# EAGLE design observer (EAGLE 6.4)
AUTHOR: B. Campbell, N. Jackson, C. Kreng, A. Zhen; REV: C; TITLE: Observer

## Sheet 1 of 2
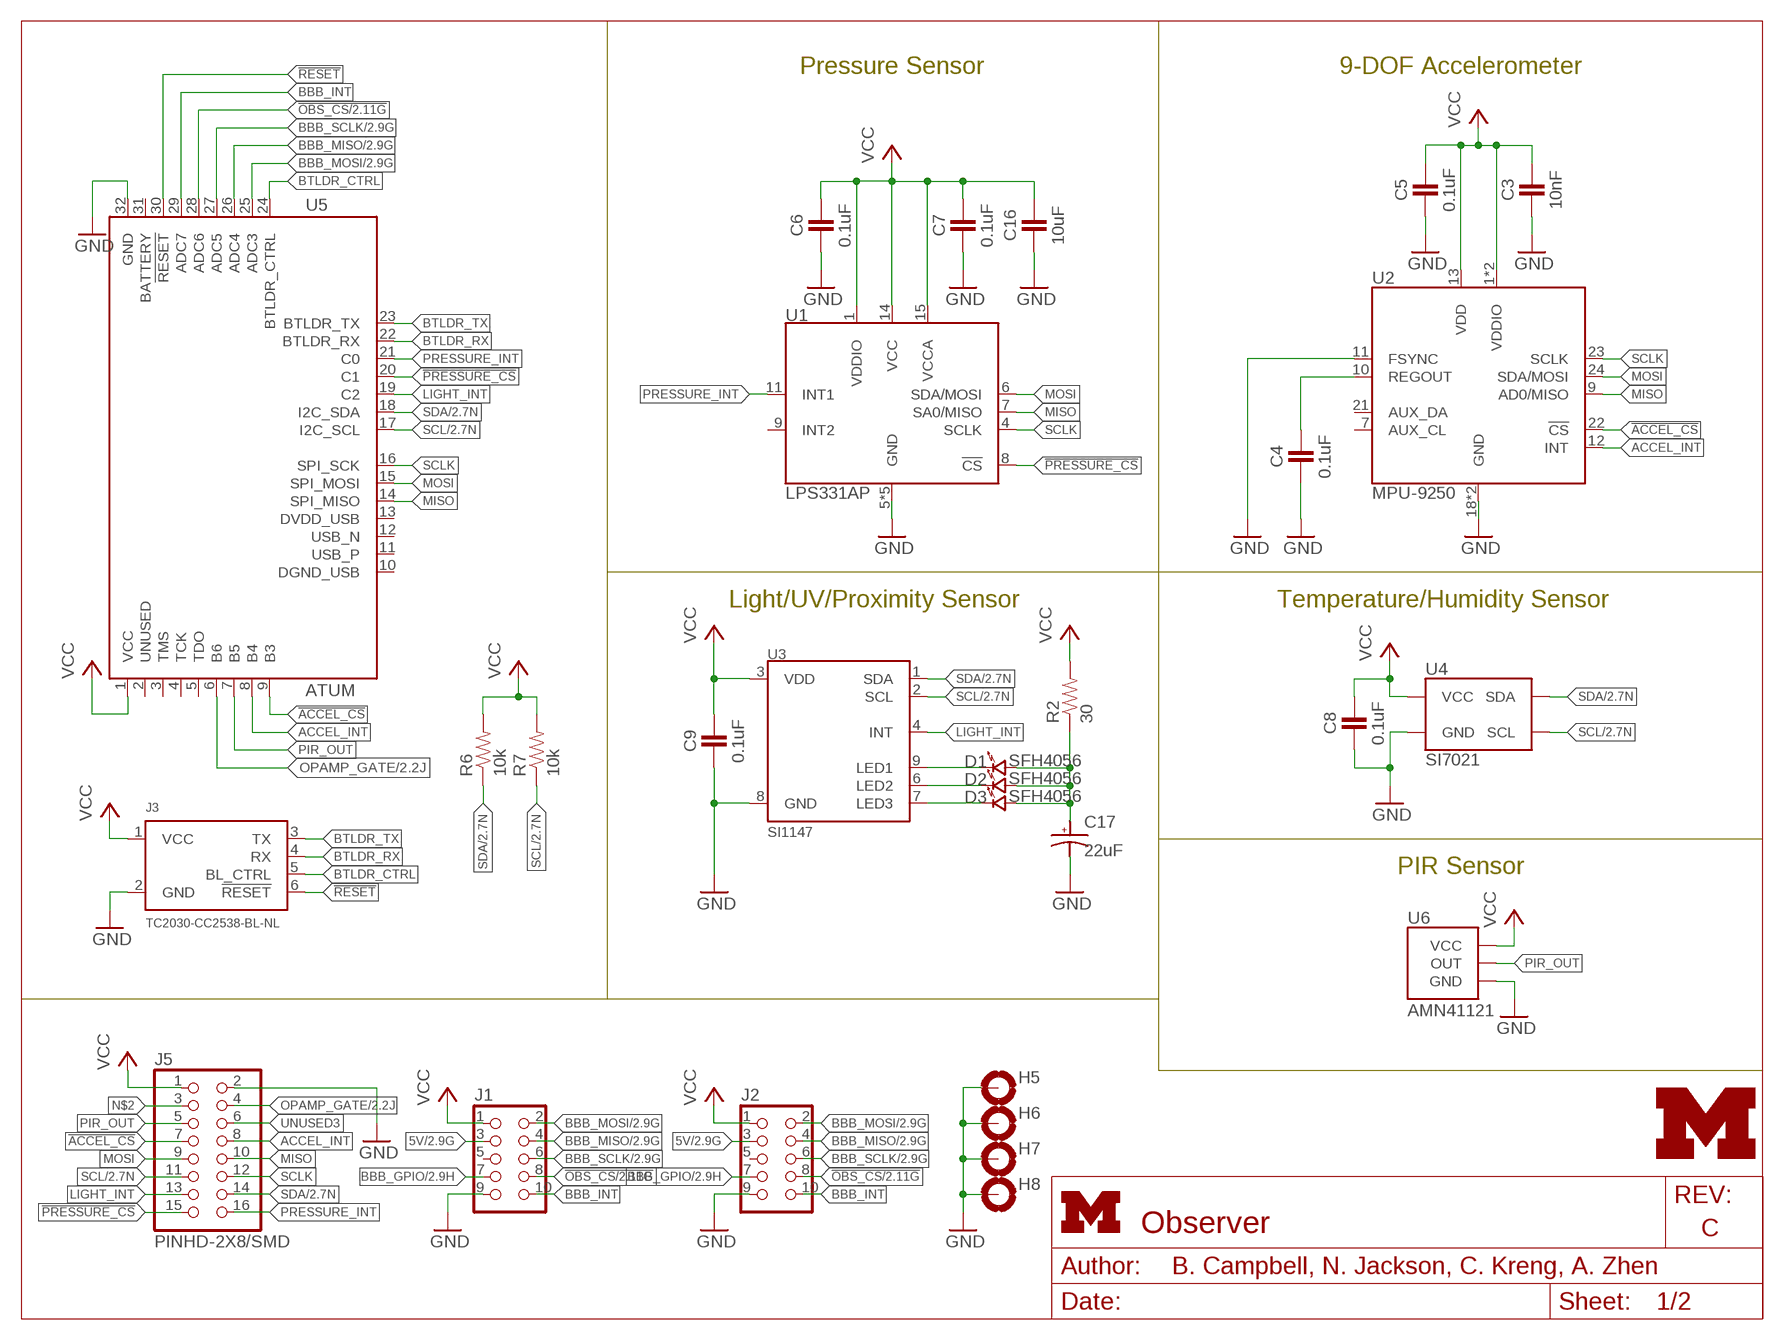
[diagram p0: schematic, sheet 1]
FRAME1 (LETTER_L): HEIGHT: 8.5in; WIDTH: 11in

### Parts
C3  10nF  CAPACITOR  [0402_CAP]
C4  0.1uF  CAPACITOR  [0402_CAP]
C5  0.1uF  CAPACITOR  [0402_CAP]
C6  0.1uF  CAPACITOR  [0402_CAP]
C7  0.1uF  CAPACITOR  [0402_CAP]
C8  0.1uF  CAPACITOR  [0402_CAP]
C9  0.1uF  CAPACITOR  [0402_CAP]
C16  10uF  CAPACITOR  [0402_CAP]
C17  22uF  CAP_POL0603  [CAP0603]
D1  SFH4056  [SFH4056]
D2  SFH4056  [SFH4056]
D3  SFH4056  [SFH4056]
H5  MOUNT-PAD-ROUND3.2  [3,2-PAD]
H6  MOUNT-PAD-ROUND3.2  [3,2-PAD]
H7  MOUNT-PAD-ROUND3.2  [3,2-PAD]
H8  MOUNT-PAD-ROUND3.2  [3,2-PAD]
J1  CON_HEADER_2X05-SMD+SHROUDED  [PINSHRD_SMT_2X05]
J2  CON_HEADER_2X05-SMD+SHROUDED  [PINSHRD_SMT_2X05]
J3  TC2030-CC2538-BL-NL  [TC2030-IDC-NL]
J5  PINHD-2X8/SMD  [2X8/SMD]
LOGO1  UMICH_SOLID_TINY  [UMICH_SOLID_50MIL]
R2  30  RESISTOR0402_RES  [0402_RES]
R6  10k  RESISTOR0402_RES  [0402_RES]
R7  10k  RESISTOR0402_RES  [0402_RES]
U1  LPS331AP  [HCLGA-16/3MM]
U2  MPU-9250  [QFN-24/3MM]
U3  SI1147  [QFN-10/2MM]
U4  SI7021  [DFN-6/3MM]
U5  ATUM  [ATUM]
U6  AMN41121  [AMN2]

### Nets
5V: J1.3 J2.3 ; also sheet 2
!ACCEL_CS: J5.7 U2.22(!CS) U5.9(B3)
!OBS_CS: J1.8 J2.8 U5.28(ADC6) ; also sheet 2
!PRESSURE_CS: J5.15 U1.8(!CS) U5.20(C1)
!RESET: J3.6(!RESET) U5.30(!RESET)
ACCEL_INT: J5.8 U2.12(INT) U5.8(B4)
BBB_GPIO: J1.7 J2.7 ; also sheet 2
BBB_INT: J1.10 J2.10 U5.29(ADC7)
BBB_MISO: J1.4 J2.4 U5.26(ADC4) ; also sheet 2
BBB_MOSI: J1.2 J2.2 U5.25(ADC3) ; also sheet 2
BBB_SCLK: J1.6 J2.6 U5.27(ADC5) ; also sheet 2
BTLDR_CTRL: J3.5(BL_CTRL) U5.24(BTLDR_CTRL)
BTLDR_RX: J3.4(RX) U5.22(BTLDR_RX)
BTLDR_TX: J3.3(TX) U5.23(BTLDR_TX)
GND: C3.2 C4.2 C5.2 C6.2 C7.2 C8.2 C9.2 C16.2 C17.NEG(ANODE) H5.B3,2(MOUNT) H6.B3,2(MOUNT) H7.B3,2(MOUNT) H8.B3,2(MOUNT) J1.9 J2.9 J3.2(GND) J5.2 U1.5(GND) U1.10(GND) U1.12(GND) U1.13(GND) U1.16(GND) U2.11(FSYNC) U2.18(GND) U2.20(GND) U3.8(GND) U4.2(GND) U5.32(GND) U6.GND ; also sheet 2
LIGHT_INT: J5.13 U3.4(INT) U5.19(C2)
MISO: J5.10 U1.7(SA0/MISO) U2.9(AD0/MISO) U5.14(SPI_MISO)
MOSI: J5.9 U1.6(SDA/MOSI) U2.24(SDA/MOSI) U5.15(SPI_MOSI)
N$2: J5.3
N$3: C4.1 U2.10(REGOUT)
N$4: D1.CATHODE U3.9(LED1)
N$6: D2.CATHODE U3.6(LED2)
N$7: D3.CATHODE U3.7(LED3)
N$8: C17.POS(CATHODE) D1.ANODE D2.ANODE D3.ANODE R2.1
OPAMP_GATE: J5.4 U5.6(B6) ; also sheet 2
PIR_OUT: J5.5 U5.7(B5) U6.OUT
PRESSURE_INT: J5.16 U1.11(INT1) U5.21(C0)
SCL: J5.11 R7.1 U3.2(SCL) U4.6(SCL) U5.17(I2C_SCL) ; also sheet 2
SCLK: J5.12 U1.4(SCLK) U2.23(SCLK) U5.16(SPI_SCK)
SDA: J5.14 R6.1 U3.1(SDA) U4.1(SDA) U5.18(I2C_SDA) ; also sheet 2
UNUSED3: J5.6
VCC: C3.1 C5.1 C6.1 C7.1 C8.1 C9.1 C16.1 J1.1 J2.1 J3.1(VCC) J5.1 R2.2 R6.2 R7.2 U1.1(VDDIO) U1.14(VCC) U1.15(VCCA) U2.1(VDDIO) U2.8(VDDIO) U2.13(VDD) U3.3(VDD) U4.5(VCC) U5.1(VCC) U6.VCC ; also sheet 2
Unconnected: J1.5 J2.5 U1.9(INT2) U2.7(AUX_CL) U2.21(AUX_DA) U5.2(UNUSED) U5.3(TMS) U5.4(TCK) U5.5(TDO) U5.10(DGND_USB) U5.11(USB_P) U5.12(USB_N) U5.13(DVDD_USB) U5.31(BATTERY)

### Notes on the sheet
- Pressure Sensor | 9-DOF Accelerometer
- Light/UV/Proximity Sensor | Temperature/Humidity Sensor
- PIR Sensor

## Sheet 2 of 2
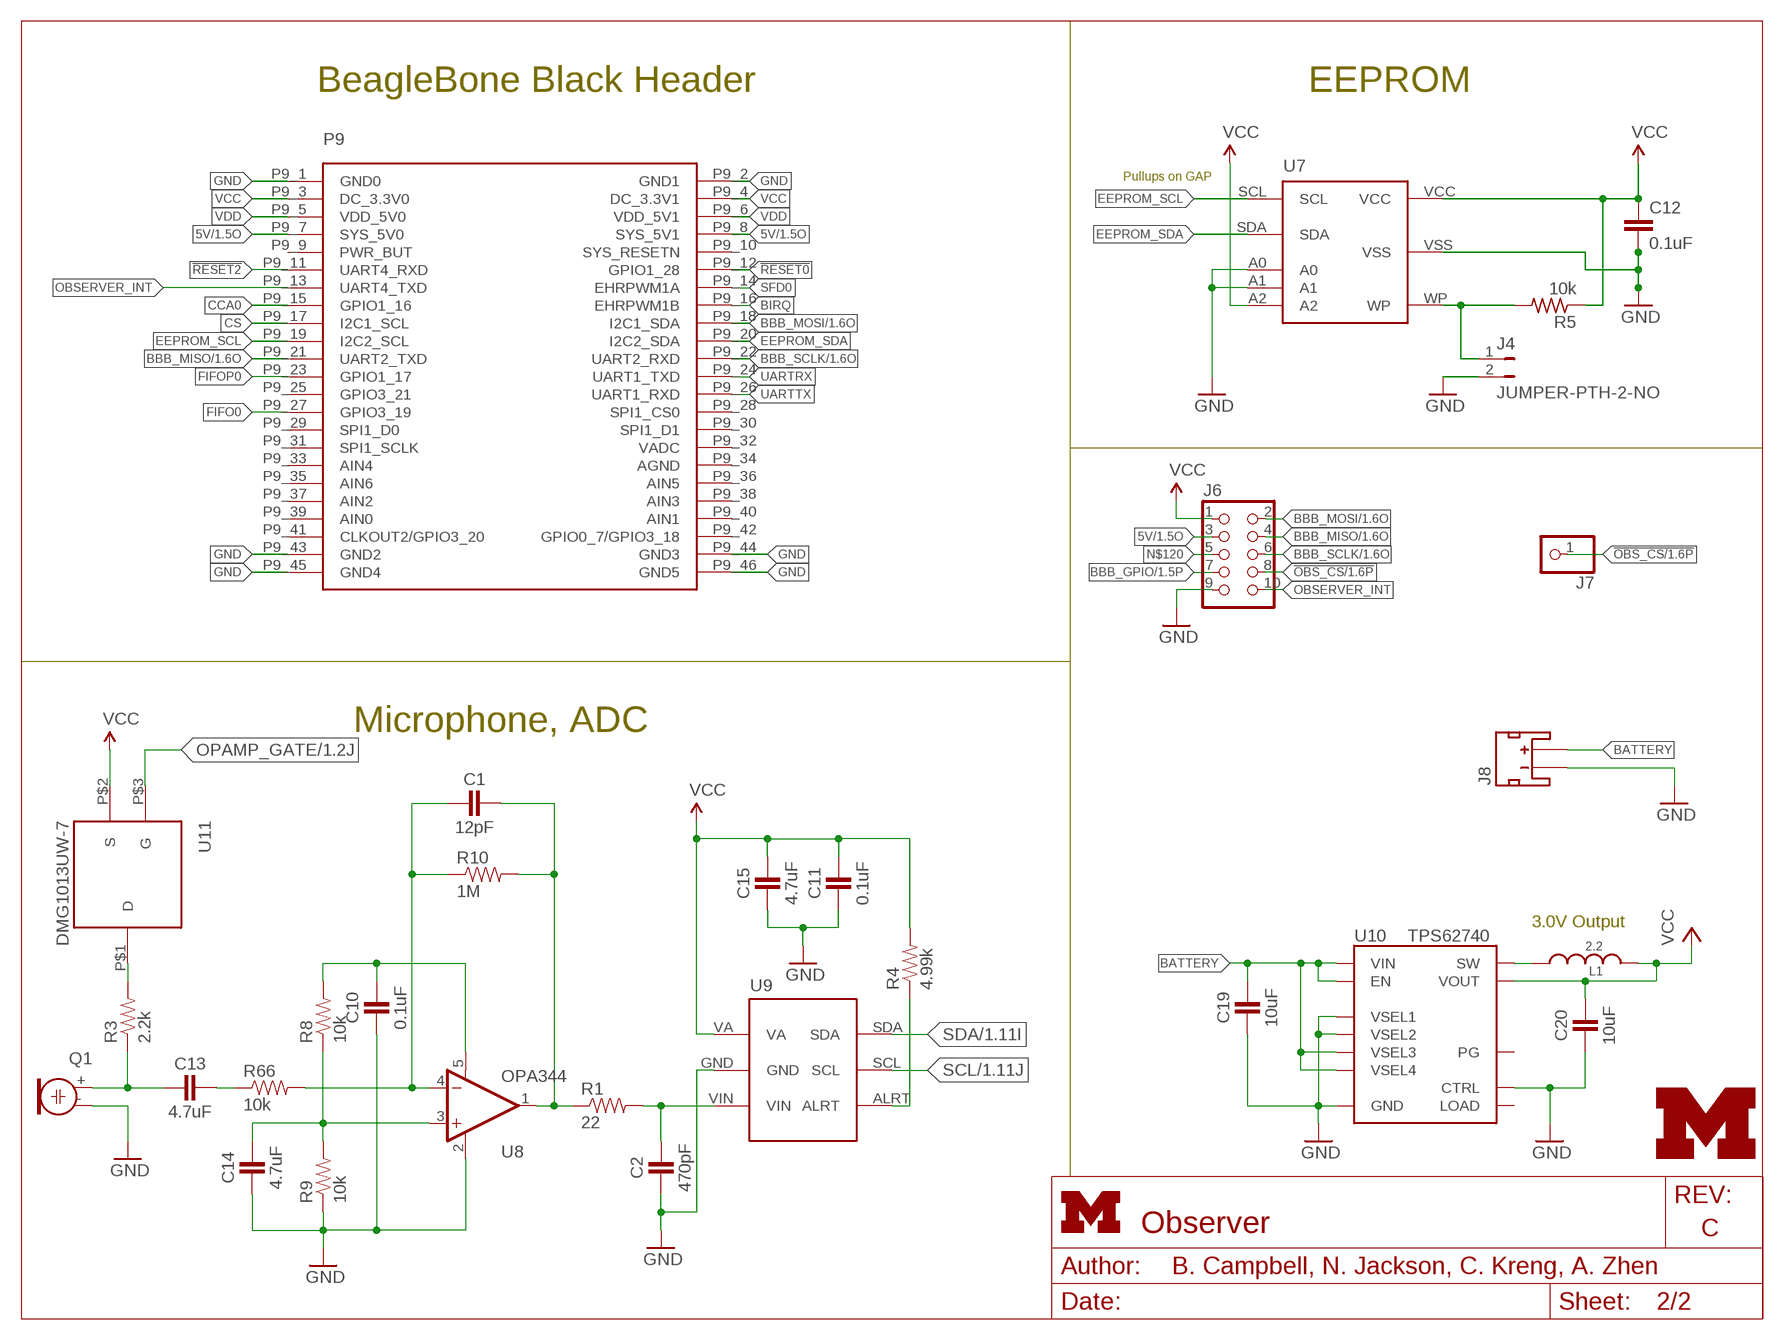
[diagram p1: schematic, sheet 2]
FRAME2 (LETTER_L): HEIGHT: 8.5in; WIDTH: 11in

### Parts
C1  12pF  CAPACITOR  [0402_CAP]
C2  470pF  CAPACITOR  [0402_CAP]
C10  0.1uF  CAPACITOR  [0402_CAP]
C11  0.1uF  CAPACITOR  [0402_CAP]
C12  0.1uF  C-EUC0402  [C0402]
C13  4.7uF  CAPACITOR  [0402_CAP]
C14  4.7uF  CAPACITOR  [0402_CAP]
C15  4.7uF  CAPACITOR  [0402_CAP]
C19  10uF  CAPACITOR0603_CAP  [0603_CAP]
C20  10uF  CAPACITOR0603_CAP  [0603_CAP]
J4  JUMPER-PTH-2-NO  [PTH-JUMPER-2-NO_NO_SILK]
J6  CON_HEADER_2X05-PTH+SHROUDED_A  [PINSHRD_PTH_2X05]
J7  PINHD-1X1  [1X01]
J8  JST_2MM_MALE  [JST-2-SMD]
L1  2.2  MIPSZ2012D  [MIPSZ201D]
LOGO2  UMICH_SOLID_TINY  [UMICH_SOLID_50MIL]
P9/P8  BBB_HEADER  [BBB_HEADERS]
Q1  ELECTRET  [ELECTRET_9.7]
R1  22  RESISTOR0402_RES  [0402_RES]
R3  2.2k  RESISTOR0402_RES  [0402_RES]
R4  4.99k  RESISTOR0402_RES  [0402_RES]
R5  10k  R-US_R0402  [R0402]
R8  10k  RESISTOR0402_RES  [0402_RES]
R9  10k  RESISTOR0402_RES  [0402_RES]
R10  1M  RESISTOR0402_RES  [0402_RES]
R66  10k  RESISTOR0402_RES  [0402_RES]
U7  CAT24C256WI-GT3  [CAT24C256WI-GT3]
U8  OPA344  [SOT23-5]
U9  ADC121C021  [ADC121C021]
U10  TPS62740  [R-PWSON-12]
U11  DMG1013UW-7  [SOT-323]

### Nets
5V: J6.3 P9/P8.P9_7(SYS_5V0) P9/P8.P9_8(SYS_5V1) ; also sheet 1
!OBS_CS: J6.8 J7.1 ; also sheet 1
!RESET0: P9/P8.P9_12(GPIO1_28)
!RESET2: P9/P8.P9_11(UART4_RXD)
BATTERY: C19.1 J8.2(+) U10.1(VIN) U10.8(VSEL4) U10.9(VSEL3) U10.12(EN)
BBB_GPIO: J6.7 ; also sheet 1
BBB_MISO: J6.4 P9/P8.P9_21(UART2_TXD) ; also sheet 1
BBB_MOSI: J6.2 P9/P8.P9_18(I2C1_SDA) ; also sheet 1
BBB_SCLK: J6.6 P9/P8.P9_22(UART2_RXD) ; also sheet 1
BIRQ: P9/P8.P9_16(EHRPWM1B)
CCA0: P9/P8.P9_15(GPIO1_16)
CS: P9/P8.P9_17(I2C1_SCL)
EEPROM_SCL: P9/P8.P9_19(I2C2_SCL) U7.SCL
EEPROM_SDA: P9/P8.P9_20(I2C2_SDA) U7.SDA
FIFO0: P9/P8.P9_27(GPIO3_19)
FIFOP0: P9/P8.P9_23(GPIO1_17)
GND: C2.2 C10.2 C11.2 C12.2 C14.2 C15.2 C19.2 C20.2 J4.2 J6.9 J8.1(-) P9/P8.P9_1(GND0) P9/P8.P9_2(GND1) P9/P8.P9_43(GND2) P9/P8.P9_44(GND3) P9/P8.P9_45(GND4) P9/P8.P9_46(GND5) Q1.- R9.1 U7.A0 U7.A1 U7.VSS U8.2(V-) U9.GND U10.3(GND) U10.4(CTRL) U10.10(VSEL2) U10.11(VSEL1) U10.NC(GND) ; also sheet 1
MIC_AIN: C1.1 R1.1 R10.2 U8.1(OUT)
MIC_INT: R4.1 U9.ALRT
N$1: C13.2 Q1.+ R3.1
N$5: C13.1 R66.1
N$9: C1.2 R10.1 R66.2 U8.4(-IN)
N$10: C14.1 R8.1 R9.2 U8.3(+IN)
N$11: C2.1 R1.2 U9.VIN
N$12: L1.1 U10.2(SW)
N$13: C10.1 R8.2 U8.5(V+)
N$14: R3.2 U11.P$1(D)
N$31: J4.1 R5.2 U7.WP
N$120: J6.5
OBSERVER_INT: J6.10 P9/P8.P9_13(UART4_TXD)
OPAMP_GATE: U11.P$3(G) ; also sheet 1
SCL: U9.SCL ; also sheet 1
SDA: U9.SDA ; also sheet 1
SFD0: P9/P8.P9_14(EHRPWM1A)
UARTRX: P9/P8.P9_24(UART1_TXD)
UARTTX: P9/P8.P9_26(UART1_RXD)
VCC: C11.1 C12.1 C15.1 C20.1 J6.1 L1.2 P9/P8.P9_3(DC_3.3V0) P9/P8.P9_4(DC_3.3V1) R4.2 R5.1 U7.A2 U7.VCC U9.VA U10.5(VOUT) U11.P$2(S) ; also sheet 1
VDD: P9/P8.P9_5(VDD_5V0) P9/P8.P9_6(VDD_5V1)
Unconnected: J8.NC1(PAD1) J8.NC2(PAD2) P9/P8.P9_9(PWR_BUT) P9/P8.P9_10(SYS_RESETN) P9/P8.P9_25(GPIO3_21) P9/P8.P9_28(SPI1_CS0) P9/P8.P9_29(SPI1_D0) P9/P8.P9_30(SPI1_D1) P9/P8.P9_31(SPI1_SCLK) P9/P8.P9_32(VADC) P9/P8.P9_33(AIN4) P9/P8.P9_34(AGND) P9/P8.P9_35(AIN6) P9/P8.P9_36(AIN5) P9/P8.P9_37(AIN2) P9/P8.P9_38(AIN3) P9/P8.P9_39(AIN0) P9/P8.P9_40(AIN1) P9/P8.P9_41(CLKOUT2/GPIO3_20) P9/P8.P9_42(GPIO0_7/GPIO3_18) U10.6(LOAD) U10.7(PG)

### Notes on the sheet
- BeagleBone Black Header | EEPROM
- Pullups on GAP
- Microphone, ADC
- 3.0V Output

## Library data of the parts
C1 C2 C10 C11 C13-C15 = passives:CAPACITOR: 0402 Capacitor
C3 = passives:CAPACITOR: 0402 Capacitor; DIGIKEY: 490-1312-1-ND
C4-C9 = passives:CAPACITOR: 0402 Capacitor; DIGIKEY: 490-1318-1-ND
C12 = rcl:C-EU: CAPACITOR, European symbol; DIGIKEY: 490-1318-1-ND
C16 = passives:CAPACITOR: 0402 Capacitor; DIGIKEY: 445-8919-1-ND
C17 = passives:CAP_POL; DIGIKEY: 511-1493-1-ND
C19 C20 = passives:CAPACITOR: 0402 Capacitor; DIGIKEY: 490-7316-1-ND
D1-D3 = leds:SFH4056: LED IR EMITTER 850NM; DIGIKEY: 475-3042-1-ND
H5-H8 = holes:MOUNT-PAD-ROUND: MOUNTING PAD, round
J1 J2 = dp_devices:CON_HEADER_2X05: 2x05 pin header; DIGIKEY: S9185-ND
J3 = connector:TC2030-CC2538-BL: Tag connect programmer for the CC2538 bootloader. The RX/TX switch happens on the programmer board, so when using this connect the TX pin to the TX pin on the CC2538 and same for the RX.
J4 = SparkFun-Passives:JUMPER-PTH-2-NO
J5 = headers:PINHD-2X8/SMD
J6 = dp_devices:CON_HEADER_2X05: 2x05 pin header
J7 = pinhead:PINHD-1X1: PIN HEADER
J8 = SparkFun-Connectors:JST_2MM_MALE: Mates to single-cell LiPo batteries. CONN-11443 Now with smashable polarity marks!; BTM_NEG: -; BTM_POS: +; PROD_ID: CONN-11443; TOP_NEG: -; TOP_POS: +
L1 = passives:MIPSZ2012D: FDK Multi-layer Power Inductor : MIPSZ2012D series (Very Small Type)
LOGO1 LOGO2 = logos:UMICH_SOLID
P9/P8 = observer:BBB_HEADER: Beaglebone Black P9 Pin Header 2x23
Q1 = observer:ELECTRET: Electret microphone Thru hole 2.54mm spacing with 9.7mm diameter
R1 R3 R4 R8-R10 R66 = passives:RESISTOR: Resistor Basic schematic elements and footprints for 0603, 1206, and PTH resistors.
R2 = passives:RESISTOR: Resistor Basic schematic elements and footprints for 0603, 1206, and PTH resistors.; DIGIKEY: RHM30CECT-ND
R5 = rcl:R-US_: RESISTOR, American symbol; DIGIKEY: RHM1.00MCDCT-ND
R6 R7 = passives:RESISTOR: Resistor Basic schematic elements and footprints for 0603, 1206, and PTH resistors.; DIGIKEY: RHM10.0KCDCT-ND
U1 = chips:LPS331AP: IC PRESSURE SENSOR PIEZO 16HCLGA; DIGIKEY: 497-12927-1-ND
U2 = chips:MPU-9250: GYRO/ACCEL/COMPASS/9-AXIS; DIGIKEY: 1428-1019-1-ND
U3 = chips:SI1147: SENSOR DGTL UV INDEX 10QFN; DIGIKEY: 336-2624-1-ND
U4 = chips:SI7021: IC TEMP SENSOR RH 2% DFN; DIGIKEY: 336-2542-1-ND
U5 = atum:ATUM: Atum sensorboard prototyping module.
U6 = chips:AMN: Passive infrared human detection sensor with built-in amp.; DIGIKEY: 255-2651-ND
U7 = bbb-cc2520:CAT24C256: 256kb Serial CMOS EEPROM, organized as 32,768 words of 8 bits each
U8 = SparkFun-AnalogIC:OPA344: Single gate rail-to-rail output op-amp. Inputs extend 300mV past rails.
U9 = observer:ADC121C021
U10 = chips:TPS62740: 360nA Step Down Converter for Low Power Applications; DIGIKEY: 296-37134-1-ND; MOUSER: 595-TPS62740DSST; NEWARK: 27X9745
U11 = pfet:DMG1013UW-7

## Board
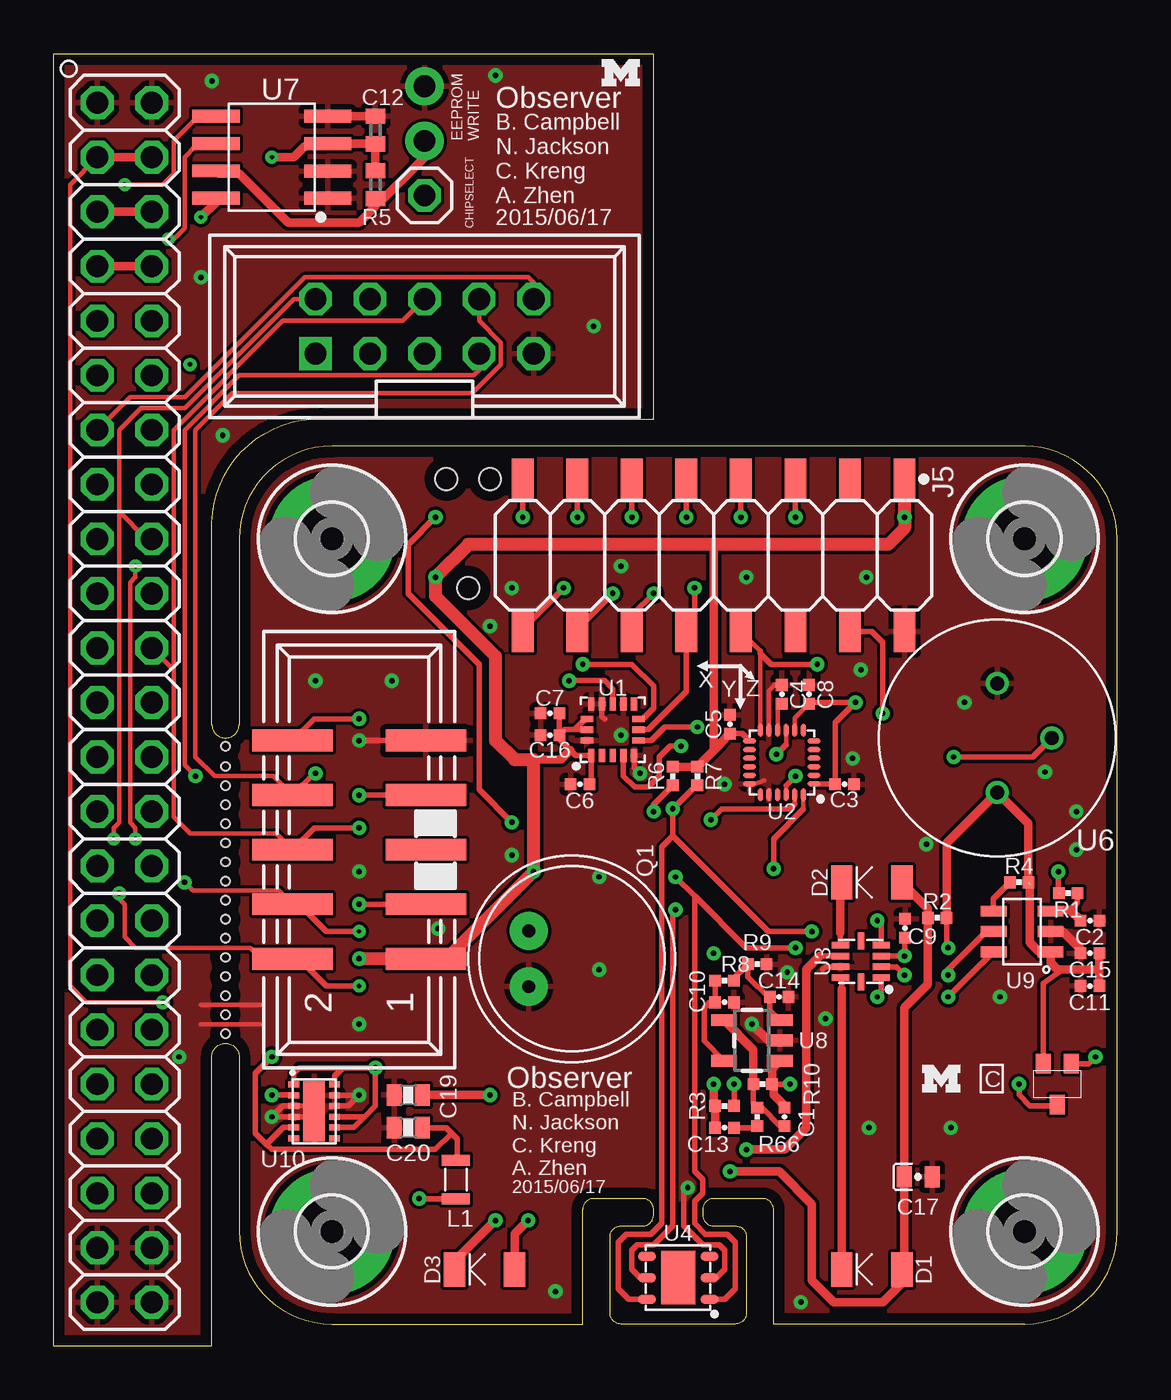
[diagram p2: board, top side]
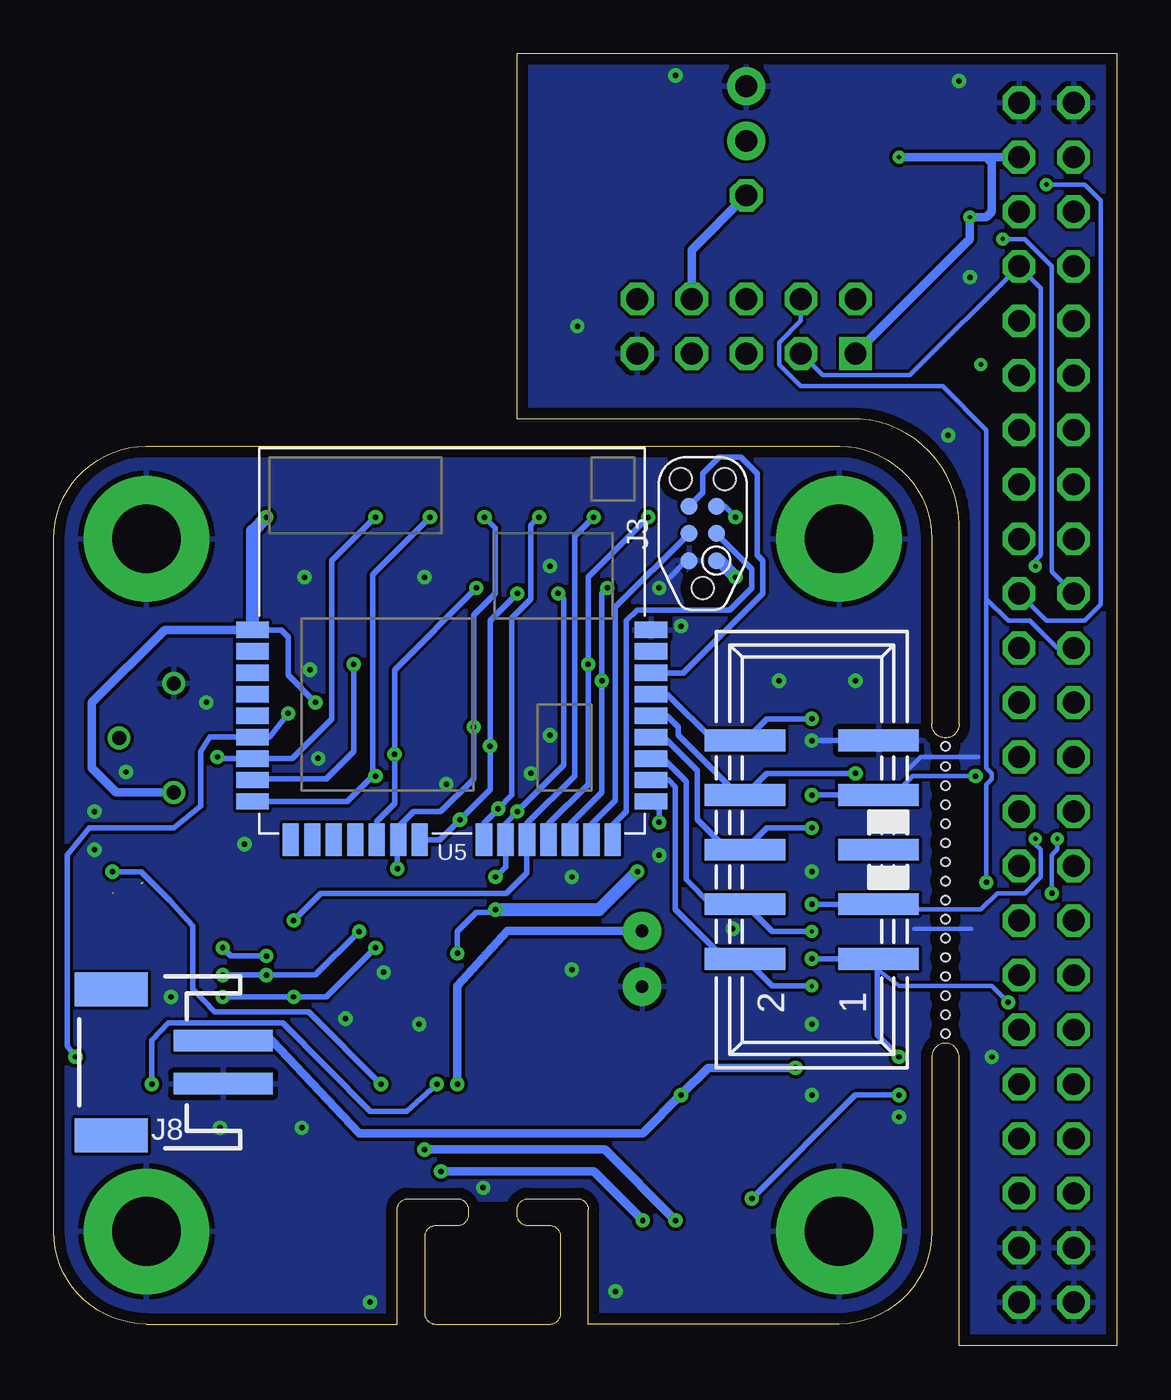
[diagram p3: board, bottom side, seen from below]

Size 49.53 x 60.2 mm. Coordinates in mm from the lower left corner, seen from the top.
Outline: 49.53,5.33 49.53,37.59 arc90 45.21,41.91 12.95,41.91 arc90 8.64,37.59 8.64,28.96 arc-180 7.37,28.96 7.37,38.35 arc-90 12.45,43.18 27.94,43.18 27.94,60.2 0,60.2 0,0 7.37,0 7.37,13.46 arc-180 8.64,13.46 8.64,5.33 arc90 12.95,1.02 24.64,1.02 24.64,6.35 arc-90 25.15,6.86 27.43,6.86 arc-90 27.94,6.35 27.94,6.1 arc-90 27.43,5.59 26.42,5.59 arc90 25.91,5.08 25.91,1.52 arc90 26.42,1.02 31.75,1.02 arc90 32.26,1.52 32.26,5.08 arc90 31.75,5.59 30.73,5.59 arc-90 30.23,6.1 30.23,6.35 arc-90 30.73,6.86 33.02,6.86 arc-90 33.53,6.35 33.53,1.02 45.21,1.02 arc90 49.53,5.33
Copper layers (1*16): Top 0.0178mm / dielectric 59mil / Bottom 0.0178mm
Design rules "sunstone-2lyr_v1.0.0.3 *": minimum track width 6mil, minimum drill 8mil, track to track 6mil, track to pad 6mil, pad to pad 6mil, via to via 6mil, smd to smd 6mil, copper to edge 20mil, drill to drill 16mil, minimum pad ring 8mil, minimum via ring 8mil, stop-mask expansion 3mil, vias tented up to drill 50mil, thermal gap 10mil
Holes 0.38 mm at 8,26.99 8,26.1 8,25.21 8,24.32 8,23.43 8,22.54 8,21.65 8,20.76 8,19.88 8,18.99 8,18.1 8,17.21 8,16.32 8,15.43 8,14.54 8,27.94

### Footprints (pad centres in the part's own frame; a part is rotated, then mirrored left to right if it is on the bottom)
0402_CAP = smd 0.536 x 0.546: 1 -0.433,0; 2 0.433,0
C0402 = smd 0.7 x 0.9: 1 -0.65,0; 2 0.65,0
CAP0603 = smd 0.7 x 1: NEG 0.65,0; POS -0.65,0
0603_CAP = smd 0.7 x 1: 1 -0.65,0; 2 0.65,0
SFH4056 = smd 1 x 1.6: ANODE 1.4,0; CATHODE -1.4,0
3,2-PAD = drill 3.2 pad 5.842: B3,2 0,0
PINSHRD_SMT_2X05 = smd 1.02 x 3.75: 1 -5.08,-3.107; 2 -5.08,3.107; 3 -2.54,-3.107; 4 -2.54,3.107; 5 0,-3.107; 6 0,3.107; 7 2.54,-3.107; 8 2.54,3.107; 9 5.08,-3.107; 10 5.08,3.107
TC2030-IDC-NL = smd 0.787 x 0.787: 1 -1.27,-0.635; 2 -1.27,0.635; 3 0,-0.635; 4 0,0.635; 5 1.27,-0.635; 6 1.27,0.635 | hole 1.016: -2.54,0; 2.54,1.016; 2.54,-1.016
PTH-JUMPER-2-NO_NO_SILK = drill 1.016 pad 1.778: 1 -1.27,0; 2 1.27,0
2X8/SMD = smd 1.016 x 1.905: 1 -8.89,-3.556; 2 -8.89,3.556; 3 -6.35,-3.556; 4 -6.35,3.556; 5 -3.81,-3.556; 6 -3.81,3.556; 7 -1.27,-3.556; 8 -1.27,3.556; 9 1.27,-3.556; 10 1.27,3.556; 11 3.81,-3.556; 12 3.81,3.556; 13 6.35,-3.556; 14 6.35,3.556; 15 8.89,-3.556; 16 8.89,3.556
PINSHRD_PTH_2X05 = drill 1.016 square: 1 -5.08,-1.27 | drill 1.016 octagon: 2 -5.08,1.27; 3 -2.54,-1.27; 4 -2.54,1.27; 5 0,-1.27; 6 0,1.27; 7 2.54,-1.27; 8 2.54,1.27; 9 5.08,-1.27; 10 5.08,1.27
1X01 = drill 1.016 octagon: 1 0,0
JST-2-SMD = smd 1 x 4.6: 1 -1,-3.7; 2 1,-3.7 | smd 1.6 x 3.4: NC1 -3.4,1.5; NC2 3.4,1.5
MIPSZ201D = smd 0.5 x 1.3: 1 -0.9,0; 2 0.9,0
BBB_HEADERS = drill 1.016 octagon: P9_1 1.27,57.15; P9_2 3.81,57.15; P9_3 1.27,54.61; P9_4 3.81,54.61; P9_5 1.27,52.07; P9_6 3.81,52.07; P9_7 1.27,49.53; P9_8 3.81,49.53; P9_9 1.27,46.99; P9_10 3.81,46.99; P9_11 1.27,44.45; P9_12 3.81,44.45; P9_13 1.27,41.91; P9_14 3.81,41.91; P9_15 1.27,39.37; P9_16 3.81,39.37; P9_17 1.27,36.83; P9_18 3.81,36.83; P9_19 1.27,34.29; P9_20 3.81,34.29; P9_21 1.27,31.75; P9_22 3.81,31.75; P9_23 1.27,29.21; P9_24 3.81,29.21; P9_25 1.27,26.67; P9_26 3.81,26.67; P9_27 1.27,24.13; P9_28 3.81,24.13; P9_29 1.27,21.59; P9_30 3.81,21.59; P9_31 1.27,19.05; P9_32 3.81,19.05; P9_33 1.27,16.51; P9_34 3.81,16.51; P9_35 1.27,13.97; P9_36 3.81,13.97; P9_37 1.27,11.43; P9_38 3.81,11.43; P9_39 1.27,8.89; P9_40 3.81,8.89; P9_41 1.27,6.35; P9_42 3.81,6.35; P9_43 1.27,3.81; P9_44 3.81,3.81; P9_45 1.27,1.27; P9_46 3.81,1.27
ELECTRET_9.7 = drill 0.6 pad 1.778: + 1.3,2; - -1.3,2
0402_RES = smd 0.536 x 0.546: 1 -0.433,0; 2 0.433,0
R0402 = smd 0.7 x 0.9: 1 -0.65,0; 2 0.65,0
HCLGA-16/3MM = smd 0.6 x 0.3: 1 -1.2,1; 2 -1.2,0.5; 3 -1.2,0; 4 -1.2,-0.5; 5 -1.2,-1; 9 1.2,-1; 10 1.2,-0.5; 11 1.2,0; 12 1.2,0.5; 13 1.2,1 | smd 0.3 x 0.6: 6 -0.5,-1.2; 7 0,-1.2; 8 0.5,-1.2; 14 0.5,1.2; 15 0,1.2; 16 -0.5,1.2
QFN-24/3MM = smd 0.6 x 0.23: 1 -1.5,1; 2 -1.5,0.6; 3 -1.5,0.2; 4 -1.5,-0.2; 5 -1.5,-0.6; 6 -1.5,-1; 13 1.5,-1; 14 1.5,-0.6; 15 1.5,-0.2; 16 1.5,0.2; 17 1.5,0.6; 18 1.5,1 | smd 0.23 x 0.6: 7 -1,-1.5; 8 -0.6,-1.5; 9 -0.2,-1.5; 10 0.2,-1.5; 11 0.6,-1.5; 12 1,-1.5; 19 1,1.5; 20 0.6,1.5; 21 0.2,1.5; 22 -0.2,1.5; 23 -0.6,1.5; 24 -1,1.5
QFN-10/2MM = smd 0.8 x 0.3: 1 -0.95,0.75; 2 -0.95,0.25; 3 -0.95,-0.25; 4 -0.95,-0.75; 6 0.95,-0.75; 7 0.95,-0.25; 8 0.95,0.25; 9 0.95,0.75 | smd 0.3 x 0.8: 5 0,-0.95; 10 0,0.95
DFN-6/3MM = smd 0.85 x 0.45: 1 -1.45,1; 2 -1.45,0; 3 -1.45,-1; 4 1.45,-1; 5 1.45,0; 6 1.45,1 | smd 1.6 x 2.5: P$1 0,0
ATUM = smd 0.754 x 1.5: 1 -9.479,-9.279; 2 -8.479,-9.279; 3 -7.479,-9.279; 4 -6.479,-9.279; 5 -5.479,-9.279; 6 -4.479,-9.279; 7 -3.479,-9.279; 8 -2.479,-9.279; 9 -1.479,-9.279; 24 -1.479,9.279; 25 -2.479,9.279; 26 -3.479,9.279; 27 -4.479,9.279; 28 -5.479,9.279; 29 -6.479,9.279; 30 -7.479,9.279; 31 -8.479,9.279; 32 -9.479,9.279 | smd 1.5 x 0.754: 10 0.3,-7.5; 11 0.3,-6.5; 12 0.3,-5.5; 13 0.3,-4.5; 14 0.3,-3.5; 15 0.3,-2.5; 16 0.3,-1.5; 17 0.3,1.5; 18 0.3,2.5; 19 0.3,3.5; 20 0.3,4.5; 21 0.3,5.5; 22 0.3,6.5; 23 0.3,7.5
AMN2 = drill 0.65: GND 1.796,-1.796; OUT -1.796,-1.796; VCC -1.796,1.796
CAT24C256WI-GT3 = smd 2.2 x 0.6: A0 -2.6,1.91; A1 -2.6,0.65; A2 -2.6,-0.64; SCL 2.6,-0.64; SDA 2.6,-1.91; VCC 2.6,1.91; VSS -2.6,-1.91; WP 2.6,0.64
SOT23-5 = smd 0.55 x 1.2: 1 -0.95,-1.3; 2 0,-1.3; 3 0.95,-1.3; 4 0.95,1.3; 5 -0.95,1.3
ADC121C021 = smd 1.2 x 0.5: ALRT 2.2,0.575; GND -0.45,1.525; SCL 2.2,1.525; SDA 2.2,2.475; VA -0.45,2.475; VIN -0.45,0.575
R-PWSON-12 = smd 0.28 x 0.5: 1 -1.25,-0.95; 2 -0.75,-0.95; 3 -0.25,-0.95; 4 0.25,-0.95; 5 0.75,-0.95; 6 1.25,-0.95; 7 1.25,0.95; 8 0.75,0.95; 9 0.25,0.95; 10 -0.25,0.95; 11 -0.75,0.95; 12 -1.25,0.95 | smd 2.8 x 1: NC 0,0
SOT-323 = smd 0.7 x 0.9: P$1 0,0.95; P$2 0.65,-0.95; P$3 -0.65,-0.95

### Placement (x,y rotation side)
C1  34.04,10.67 270 top
C2  48.26,19.81 0 top
C3  36.83,26.16 0 top
C4  33.91,30.35 90 top
C5  31.5,28.96 90 top
C6  24.51,26.16 180 top
C7  23.11,29.46 180 top
C8  35.18,30.35 90 top
C9  39.65,19.46 90 top
C10  31.24,16 0 top
C11  48.26,16.76 180 top
C12  14.99,56.64 90 top
C13  31.24,10.16 180 top
C14  33.78,16.26 0 top
C15  48.26,18.29 180 top
C16  23.11,28.45 180 top
C17  40.26,7.87 0 top
C19  16.51,11.68 180 top
C20  16.51,10.16 180 top
D1  38.1,3.56 0 top
D2  38.1,21.59 0 top
D3  20.07,3.56 0 top
H5  45.21,37.59 180 top
H6  45.21,5.33 180 top
H7  12.95,5.33 180 top
H8  12.95,37.59 0 top
J1  14.22,23.11 90 bottom
J2  14.22,23.11 90 top
J3  19.3,37.85 90 bottom
J4  17.27,57.4 90 top
J5  30.73,36.83 180 top
J6  17.27,47.5 0 top
J7  17.27,53.59 0 top
J8  45.34,13.21 90 bottom
L1  18.73,7.75 90 top
LOGO1  41.33,12.45 0 top
LOGO2  26.42,59.31 0 top
P9/P8  0.76,0.76 0 top
Q1  24.13,18.03 90 top
R1  47.24,21.08 0 top
R2  41.15,19.94 0 top
R3  31.24,11.18 0 top
R4  44.96,21.59 0 top
R5  14.99,54.1 270 top
R6  28.83,26.54 90 top
R7  29.97,26.54 90 top
R8  31.24,17.02 180 top
R9  32.77,17.78 180 top
R10  33.02,12.19 0 top
R66  32.77,10.67 90 top
U1  26.04,28.7 90 top
U2  33.91,27.18 180 top
U3  37.59,17.91 180 top
U4  29.08,3.17 180 top
U5  30.99,23.88 270 bottom
U6  43.94,28.32 135 top
U7  10.16,55.37 180 top
U8  32.51,14.22 90 top
U9  45.97,20.83 180 top
U10  12.13,10.92 270 top
U11  46.74,12.19 180 top

### Tracks (layer width: path | path; a pad name or v marks a point on that pad's centre or on a via)
5V  (via drill 0.2, 0.25)
  Top 0.203: v3.81,36.32 3.81,35.81 3.56,35.56 3.56,24.38 3.81,24.13 v3.81,23.62
  Top 0.254: J2.3 v14.22,20.57
  Top 0.406: P9/P8.P9_7 P9/P8.P9_8
  Bottom 0.203: J6.3 13.72,45.21 9.65,45.21 P9/P8.P9_8 3.56,49.28 3.56,36.83 3.81,36.58 v3.81,36.32 | v3.81,23.62 3.81,23.37 3.56,23.11 3.56,21.84 4.32,21.08 5.59,21.08 6.35,20.32 10.03,20.32 10.41,20.7 | J1.3 10.99,20.7 10.41,20.7 | 10.41,20.7 9.53,20.7 9.4,20.57
  Bottom 0.254: v14.22,20.57 J1.3
!ACCEL_CS  (via drill 0.25)
  Top 0.203: 34.11,26.11 U2.22
  Top 0.254: 34.11,26.11 v34.54,26.54 | J5.7 v32,38.61
  Bottom 0.254: U5.9 35.86,25.36 34.67,26.54 | v34.54,26.54 34.67,26.54 | 34.67,26.54 34.67,35.94 v32,38.61
!OBS_CS  (via drill 0.25)
  Top 0.203: J6.8 19.81,47.75 20.83,46.74 20.83,45.72 19.49,44.39 8.32,44.39 6.6,42.67 6.6,27.43 7.49,26.54 10.23,26.54 J2.8 10.74,26.04
  Top 0.254: 10.92,25.65 J2.8 12.13,26.67 v12.19,26.67
  Bottom 0.254: U5.28 20.97,29.36 20.45,28.83 20.45,28.45 17.65,25.65 J1.8 16.32,26.67 v12.19,26.67
  Bottom 0.406: J6.8 19.81,51.05 J7.1
!PRESSURE_CS  (via drill 0.25)
  Top 0.254: v24.64,31.75 26.92,31.75 27.94,30.73 27.94,29.72 27.42,29.2 U1.8 | J5.15 v21.84,38.61
  Bottom 0.254: U5.20 26.49,24.31 24.64,26.16 v24.64,31.75 24.64,35.81 v21.84,38.61
!RESET
  Bottom 0.254: J3.6 19.3,39.75 19.3,40.64 18.54,41.4 17.53,41.4 16.76,40.64 16.76,36.83 16.51,36.58 16.51,35.05 20.21,31.36 U5.30
ACCEL_INT  (via drill 0.25)
  Top 0.203: U2.12 32.91,32.26 | 32.91,32.37 J5.8
  Top 0.254: 32.91,32.37 32.91,32.26 33.42,31.75 v35.56,31.75
  Bottom 0.254: v35.56,31.75 35.56,27.69 36.83,26.42 40.21,26.42 U5.8
BATTERY  (via drill 0.25)
  Top 0.254: U10.9 14.48,10.67 | 14.48,10.67 14.99,11.18 v14.99,12.95 13.46,12.95 | 13.46,12.95 11.43,12.95 11.18,12.7 U10.1 | U10.8 13.98,10.17 14.48,10.67 | U10.12 13.08,12.57 13.46,12.95
  Top 0.406: C19.1 v20.32,11.68
  Bottom 0.406: J8.2 39.35,14.21 35.31,9.91 22.1,9.91 v20.32,11.68 19.05,12.95 v14.99,12.95
BBB_GPIO  (via drill 0.25)
  Top 0.203: J6.7 19.81,45.47 19.56,45.21 8.64,45.21 6.1,42.67 6.1,27.05 v6.6,26.54
  Top 0.254: J2.7 v14.22,25.65
  Bottom 0.203: J1.7 10.74,26.04 10.61,25.91 10.16,25.91 | 9.78,26.04 9.91,25.91 10.16,25.91 | v6.6,26.54 9.53,26.54 10.16,25.91
  Bottom 0.254: v14.22,25.65 J1.7
BBB_INT  (via drill 0.25)
  Top 0.254: v14.22,29.21 12.13,29.21 J2.10
  Bottom 0.254: v14.22,29.21 16.32,29.21 J1.10 18.8,28.19 20.96,30.36 U5.29
BBB_MISO  (via drill 0.2, 0.25)
  Top 0.203: J2.4 10.48,21.21 6.48,21.21 v6.1,21.59
  Top 0.254: J2.4 11.43,20.57 12.7,19.3 v14.22,19.3
  Bottom 0.203: J6.4 14.73,47.75 15.75,46.74 15.75,45.72 14.73,44.7 8.13,44.7 6.1,42.67 6.1,34.8 | P9/P8.P9_21 2.79,32.51 4.06,33.78 5.08,33.78 6.1,34.8 | v6.1,21.59 6.1,26.16 5.84,26.42 5.84,26.67 6.1,26.92 6.1,34.8
  Bottom 0.254: U5.26 21.13,27.36 20.07,26.29 20.07,21.72 18.92,20.57 J1.4 16.06,19.3 v14.22,19.3
BBB_MOSI  (via drill 0.2, 0.25)
  Top 0.203: J6.2 11.18,48.77 6.1,43.69 4.06,43.69 3.05,42.67 3.05,38.86 | v2.79,23.62 2.79,24.13 3.05,24.38 3.05,38.86 | P9/P8.P9_18 4.32,37.59 3.05,38.86 | J2.2 9.65,18.03 9.14,18.54 3.81,18.54 3.3,19.05 3.3,20.57 3.05,20.83 v3.05,21.08
  Top 0.254: J2.2 11.43,18.03 12.7,16.76 v14.22,16.76
  Bottom 0.203: v2.79,23.62 2.79,23.11 3.05,22.86 v3.05,21.08
  Bottom 0.254: U5.25 20.89,26.36 20.57,26.04 20.57,20.32 18.29,18.03 J1.2 16.06,16.76 v14.22,16.76
BBB_SCLK  (via drill 0.25)
  Top 0.203: 12.13,24.13 12.13,24.07 11.18,23.11 | 5.59,31.5 P9/P8.P9_22 | J6.6 16.26,47.75 10.67,47.75 5.59,42.67 5.59,31.5 | 10.86,23.37 J2.6 10.35,23.88 6.35,23.88 5.59,24.64 5.59,31.5
  Top 0.254: J2.6 12.13,24.13 v14.22,24.13
  Bottom 0.254: U5.27 21.12,28.36 19.56,26.8 19.56,24.51 18.29,23.24 18.29,23.11 J1.6 16.32,24.13 v14.22,24.13
BTLDR_CTRL  (via drill 0.25)
  Top 0.254: v21.34,24.38 19.81,25.91 19.81,31.75 16.51,35.05 16.51,37.34 v17.78,38.61
  Bottom 0.254: U5.24 21.34,24.98 v21.34,24.38 | v17.78,38.61 18.29,39.12 J3.5
BTLDR_RX
  Bottom 0.254: U5.22 24.49,24.28 23.37,25.4 23.37,34.42 J3.4
BTLDR_TX
  Bottom 0.254: J3.3 17.02,36.2 17.02,35.31 18.03,34.29 22.35,34.29 22.86,33.78 22.86,24.89 23.49,24.26 U5.23
EEPROM_SCL  (via drill 0.2)
  Top 0.203: 7.69,55.88 U7.SCL | 7.68,56.13 U7.SCL | v5.33,51.56 5.59,51.56 6.1,52.07 6.1,55.37 6.6,55.88 7.43,55.88 U7.SCL
  Bottom 0.203: P9/P8.P9_19 3.05,36.07 3.05,50.29 4.32,51.56 v5.33,51.56
EEPROM_SDA  (via drill 0.2)
  Top 0.203: U7.SDA 7.44,57.4 6.86,57.4 5.59,56.13 5.59,54.61 5.08,54.1 v3.3,54.1
  Bottom 0.203: P9/P8.P9_20 3.3,33.78 1.52,33.78 0.76,34.54 0.76,53.34 1.52,54.1 v3.3,54.1
GND  (via drill 0.25)
  Top 0.203: U2.11 33.31,30.52 33.58,30.79 | U2.18 32.77,26.21 33.1,26.34 | P9/P8.P9_44 4.57,5.08 | U10.3 11.88,11.17 U10.NC | 6.86,14.99 9.65,14.99 | 6.86,15.88 9.65,15.88
  Top 0.254: U4.2 30.86,3.17 31.24,3.56 31.24,4.45 30.99,4.7 30.23,4.7 29.34,5.59 29.34,7.24 | J2.9 v14.22,28.19 | 33.58,30.79 C4.2 | U1.5 27.04,26.94 v27.3,26.67 | U1.12 25.54,29.33 25.65,29.21 | U3.8 35.95,17.66 35.81,17.53 | U10.4 v10.16,10.67 10.66,11.17 U10.3 | U10.4 | U10.10 13.71,11.17 v14.22,11.68 v14.21,11.67 U10.11 | U10.4 12.19,10.67
  Top 0.406: U7.VSS 14.98,57.28 C12.2 | U9.GND 46.99,19.3 47.83,18.47 | U8.2 33.27,14.22 v32.51,14.99
  Bottom 0.203: 6.48,27.43 9.14,27.43 9.65,26.92 | 6.79,19.43 9.46,19.43
  Bottom 0.254: v14.22,28.19 J1.9 | J3.2 20.07,36.58 20.83,35.81
  other vias: 26.42,28.45 42.42,29.97 37.21,27.37 31.24,26.16 20.32,33.53 26.42,36.32 21.34,35.31 15.75,30.99 29.53,7.37 35.94,15.24 12.19,30.99 23.37,2.54 34.8,2.03 40.64,23.37 25.4,21.84 32.26,35.81 37.85,35.81 21.34,22.86 17.91,19.43 34.16,17.4 6.86,49.78 20.57,59.18 7.37,58.93 47.62,24.89 46.16,26.73 14.22,22.1 7.87,42.42 5.84,13.46 44.07,16.26 37.97,10.16 41.78,10.16 47.62,23.11 25.15,47.5 14.22,14.99 25.4,17.53 37.59,31.5
  pour Bottom: 49.53,1.02 33.53,1.02 33.53,6.86 24.64,6.86 24.64,1.02 8.64,1.02 8.61,37.87 arc-90 12.93,41.91 49.53,41.91
  pour Top: 49.53,1.02 33.53,1.02 33.53,6.86 24.64,6.86 24.64,1.02 8.64,1.02 8.61,37.62 arc-90 12.93,41.91 49.53,41.91
  pour Bottom: 27.94,43.18 12.19,43.18 arc90 7.37,38.35 7.62,0 0,0 0,60.45 27.94,60.45
  pour Top: 27.94,43.18 12.19,43.18 arc90 7.37,38.35 7.62,0 0,0 0,60.45 27.94,60.45
LIGHT_INT  (via drill 0.25)
  Top 0.254: J5.13 v24.38,38.61 | v38.35,19.81 38.54,19.62 U3.4
  Bottom 0.254: v24.38,38.61 25.27,37.72 25.27,26.54 27.49,24.33 U5.19 27.49,22.04 28.45,21.08 37.08,21.08 v38.35,19.81
MIC_AIN  (via drill 0.25)  (1 unrouted)
  Top 0.254: R10.2 v34.29,12.19 | v46.79,22.09 46.79,21.11
  Top 0.406: C1.1 34.04,11.18 33.53,11.68 33.53,12.12 R10.2 33.45,12.91 U8.1
  Bottom 0.254: v34.29,12.19 37.66,15.56 42.04,15.56 43.05,16.64 43.05,19.56 44.12,20.75 45.45,22.09 v46.79,22.09
MIC_INT
  Top 0.254: 43.69,20.34 U9.ALRT 43.76,20.26 43.76,20.83 R4.1
MISO  (via drill 0.25)
  Top 0.203: U2.9 34.11,28.01
  Top 0.254: 34.11,28.01 v33.66,27.56 | v29.84,35.31 29.84,33.66 J5.10 29.46,30.48 27.69,28.7 U1.7
  Bottom 0.254: U5.14 34.49,24.44 33.66,25.27 v33.66,27.56 33.66,31.5 v29.84,35.31
MOSI  (via drill 0.25)
  Top 0.203: 34.91,25 U2.24
  Top 0.254: 34.91,25 33.53,23.62 v33.53,22.23 | J5.9 v29.46,38.61 | U1.6 27.82,28.2 28.45,28.83 v29.97,28.83
  Bottom 0.254: v33.53,22.23 33.53,23.54 U5.15 33.49,24.17 32.77,24.89 31.5,24.89 29.97,26.42 v29.97,28.83 29.97,34.04 28.96,35.05 28.96,38.1 v29.46,38.61
N$1  (via drill 0.25)
  Top 0.406: v30.73,12.19 30.73,11.25 R3.1 C13.2
  Bottom 0.406: Q1.+ 28.42,19.33 30.73,16.76 v30.73,12.19
N$3
  Top 0.203: C4.1 33.71,29.74 U2.10
N$4
  Top 0.254: 36.7,16.64 36.7,17.1 U3.9
  Top 0.406: D1.CATHODE 36.7,16.64
N$5
  Top 0.254: C13.1 32.69,10.16 R66.1
N$6
  Top 0.254: 36.64,19.24 U3.6
  Top 0.406: D2.CATHODE 36.64,21.53 36.64,19.24
N$7  (via drill 0.25)
  Top 0.254: 35.68,18.16 U3.7
  Top 0.406: v32.26,9.14 34.04,9.14 35.05,10.16 35.05,17.53 35.68,18.16 | D3.CATHODE 18.67,3.93 v20.57,5.84
  Bottom 0.406: v32.26,9.14 23.88,9.14 v20.57,5.84
N$8  (via drill 0.25)
  Top 0.406: v31.5,8.13 33.78,8.13 35.31,6.6 35.31,3.05 36.32,2.03 38.61,2.03 39.5,2.92 D1.ANODE 39.61,3.67 C17.POS 39.61,15.73 40.72,16.84 R2.1 40.72,20.38 D2.ANODE | v22.1,5.84 21.47,5.21 D3.ANODE
  Bottom 0.406: v31.5,8.13 24.38,8.13 v22.1,5.84
N$9
  Top 0.254: 33.89,10.23 C1.2 33.83,10.23 32.97,11.1 R66.2 32.59,11.28 R10.1
  Top 0.406: R10.1 32.59,13.8 U8.4
N$10
  Top 0.254: U8.3 33.35,15.64 C14.1 33.27,16.26 32.33,17.2 R9.2 31.68,17.12 R8.1
N$11
  Top 0.254: R1.2 47.68,20.66 47.33,20.31
  Top 0.406: U9.VIN 46.48,20.31 47.33,20.31 C2.1
N$12  (via drill 0.25)
  Top 0.203: v17.02,6.86 17.03,6.85
  Top 0.254: 17.03,6.85 L1.1 | U10.2 11.18,11.68 v10.16,11.68
  Bottom 0.254: v17.02,6.86 12.19,11.68 v10.16,11.68
N$13
  Top 0.254: R8.2 C10.1 30.54,16 30.29,15.75 30.29,14.2 U8.5
N$14  (via drill 0.25)
  Top 0.254: v31.69,12.19 R3.2 | v44.96,12.19 44.96,11.68 45.47,11.18 46.92,11.18 U11.P$1
  Bottom 0.254: v44.96,12.19 44.96,14.22 44.2,15.05 38.86,15.05 34.8,10.92 33.08,10.92 v31.69,12.19
N$31
  Top 0.406: U7.WP 7.68,54.61 8.64,54.61 10.92,52.32 14.22,52.32 14.99,53.09 R5.2 15.35,53.45 17.27,55.37 J4.1
NAME  (via drill 0.2)
  other vias: 6.35,45.72
OBSERVER_INT
  Top 0.203: J6.10 22.35,49.53 22.1,49.78 11.68,49.78 6.1,44.2 3.56,44.2 P9/P8.P9_13
OPAMP_GATE  (via drill 0.25)
  Top 0.254: U11.P$3 48.19,13.14 v48.51,13.46 | J5.4 38.1,33.27 38.61,32.77 v38.61,29.46
  Bottom 0.254: v48.51,13.46 48.9,13.97 48.9,22.86 47.88,24.13 43.94,24.13 42.67,25.15 42.67,27.69 42.26,28.36 U5.6 39.46,28.36 v38.61,29.46
PIR_OUT  (via drill 0.25)
  Top 0.254: v34.54,38.61 J5.5 | v41.91,27.43 45.59,27.43 U6.OUT
  Bottom 0.254: v34.54,38.61 36.58,36.58 36.58,29.21 38.43,27.36 U5.7 41.83,27.36 v41.91,27.43
PRESSURE_INT  (via drill 0.25)
  Top 0.254: U1.11 26.04,30.61 25.65,30.99 v24,30.99 | v23.75,35.31 21.84,33.4 J5.16
  Bottom 0.254: U5.21 25.49,24.3 24,25.78 v24,30.99 24,35.05 v23.75,35.31
SCL  (via drill 0.25)
  Top 0.254: U4.6 26.78,2.17 26.29,2.67 26.29,4.83 26.67,5.21 27.81,5.21 28.32,5.71 28.32,23.24 28.83,23.75 | R7.1 29.97,26.16 v28.83,25.02 28.83,23.75 | J5.11 v26.92,38.61 | 28.83,23.75 33.27,19.3 v35.31,19.3 | v39.62,17.27 39.24,17.66 U3.2 | U9.SCL 43.43,19.3 41.66,17.53 v41.66,17.27
  Bottom 0.254: U5.17 29.49,24.36 v28.83,25.02 28.19,25.65 28.19,33.91 27.3,34.8 27.3,38.23 v26.92,38.61 | v35.31,19.3 37.34,17.27 v39.62,17.27 v41.66,17.27
SCLK  (via drill 0.25)
  Top 0.203: 34.51,25.24 U2.23
  Top 0.254: 34.51,25.24 34.29,25.02 31.11,25.02 v30.61,24.51 | J5.12 26.92,34.04 v27.94,35.05 | U1.4 26.54,26.55 27.05,26.04 27.69,26.04 28.19,26.54 28.19,27.43 28.7,27.94 v29.21,27.94
  Bottom 0.254: U5.16 31.54,23.58 v30.61,24.51 29.21,25.91 v29.21,27.94 29.21,33.78 v27.94,35.05
SDA  (via drill 0.25)
  Top 0.254: U4.1 31.26,2.17 31.75,2.67 31.75,4.83 31.37,5.21 30.35,5.21 29.84,5.71 29.84,6.73 30.23,7.11 30.23,7.75 29.84,8.13 29.84,20.95 | J5.14 24.38,33.4 v26.04,35.05 | v27.94,24.89 27.94,25.22 R6.1 | 29.84,20.95 v28.96,21.84 | v34.54,18.54 32.26,18.54 29.84,20.95 | v38.35,16.26 38.54,16.44 U3.1 | U9.SDA 43.75,18.35 v41.66,16.26
  Bottom 0.254: v26.04,35.05 25.78,34.8 25.78,27.05 v27.94,24.89 28.49,24.34 U5.18 28.49,22.31 v28.96,21.84 | v34.54,18.54 36.83,16.26 v38.35,16.26 v41.66,16.26
VCC  (via drill 0.2, 0.25)  (1 unrouted)
  Top 0.203: C8.1 34.51,29.25 U2.8 | 2.03,55.24 P9/P8.P9_3 0.76,54.1 0.76,16.76 1.52,16 v5.08,16
  Top 0.254: U4.5 27.3,3.17 26.92,3.56 26.92,4.45 27.18,4.7 27.94,4.7 28.83,5.59 28.83,20.19 v28.96,20.32 | C6.1 25.04,26.25 U1.1 24.31,27.5 24.07,27.75 23.55,28.27 C16.1 | U1.15 24.26,28.7 | 24.26,28.7 23.8,28.7 C16.1 | C16.1 C7.1 | U1.14 24.76,29.2 24.26,28.7 | 35.42,26.16 U2.1 36.38,26.18 C3.1 36.4,29.03 v37.34,29.97 35.23,29.97 C8.1 | R2.2 41.58,18.62 v41.66,18.54 | C9.1 39.62,19 v39.62,18.16 U3.3 | C5.1 32.06,28.52 U2.13 | 30.81,18.21 v30.73,18.29 | U10.5 10.68,10.17 9.91,9.4 | v10.16,13.46 9.4,12.7 9.4,9.91 9.91,9.4 | U11.P$2 46.09,16.88 46.99,17.53 | 9.91,9.4 10.16,9.14 17.78,9.14 18.54,9.91 | C20.1 18.29,10.16 18.54,9.91 | 18.54,9.91 18.8,9.65 18.8,8.71 L1.2
  Top 0.406: R6.2 R7.2 30.73,27.74 | 30.73,37.34 30.73,27.74 | 22.35,27.3 23.62,27.3 24.07,27.75 | 30.73,27.74 31.04,28.04 31.04,28.07 C5.1 | R2.2 41.58,23.42 U6.VCC 45.39,24.33 R4.2 | P9/P8.P9_4 P9/P8.P9_3 | R5.1 C12.1 14.97,56.01 U7.A2 12.63,55.88 11.68,55.88 11.18,55.37 v10.16,55.37 | U7.VCC 7.56,53.28 v6.86,52.58 | 45.47,21.52 45.47,18.8 45.91,18.35 U9.VA 46.42,17.84 46.74,17.53 46.99,17.53 48.69,17.53 | 48.69,17.53 C15.1 | 48.69,17.53 C11.1
  Top 0.61: v14.22,18.03 J2.1 18.29,18.03 v22.35,22.1 22.35,27.3 21.46,27.3 20.57,28.19 20.57,32.13 17.78,34.92 v17.78,35.81 19.3,37.34 30.73,37.34 38.86,37.34 39.62,38.1 v39.62,38.61 J5.1
  Bottom 0.203: J1.1 11.18,17.97 11.18,17.53 10.16,16.76 5.84,16.76 v5.08,16
  Bottom 0.254: v14.22,18.03 J1.1 | U5.1 38.94,33.35 38.61,33.02 38.61,31.24 v37.34,29.97 | v41.66,18.54 41.27,18.16 v39.62,18.16 | v30.73,18.29 30.73,19.3 29.84,20.19 29.08,20.19 v28.96,20.32 | v10.16,13.46 11.18,14.48 11.18,17.53
  Bottom 0.406: U5.1 44.37,33.35 47.75,29.97 47.75,26.92 46.61,25.78 U6.VCC | P9/P8.P9_4 6.1,55.37 | 6.1,55.37 v10.16,55.37 | 6.1,55.37 5.84,55.12 5.84,52.83 6.1,52.58 v6.86,52.58 6.86,51.56 J6.1
  Bottom 0.61: U5.1 40.27,37.97 v39.62,38.61 | v17.78,35.81 18.54,36.58 J3.1 | v28.96,20.32 24.13,20.32 v22.35,22.1
VDD
  Top 0.406: P9/P8.P9_6 P9/P8.P9_5

### Text on the board
tPlace: Observer | B. Campbell / N. Jackson / C. Kreng / A. Zhen | 2015/06/17 | X | Y | Z | Observer | C | B. Campbell / N. Jackson / C. Kreng / A. Zhen | 2015/06/17
tNames: EEPROM / WRITE | CHIPSELECT